# Altium schematic sheet 06-Power.SchDoc
size A
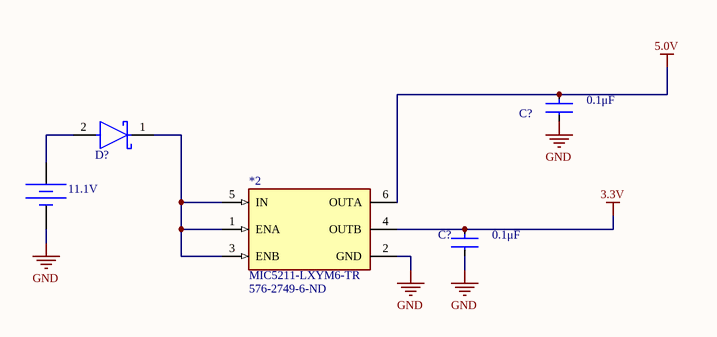
[diagram p0: 06-Power.SchDoc]

## Parts
(Parts that share a designator on the sheet are numbered #1, #2 ... from top to bottom, then left to right.)
11.1V  Constant Voltage Source  (value not drawn)
*2  MIC5211-LXYM6-TR  Supplier Part Number 1: 576-2749-6-ND  [FP-SOT23-6LD-PL-1-MFG]
C?#1  C0805C104K1RACAUTO  [FP-C0805C-DN-IPC_A]  (value not drawn)
C?#2  C0805C104K1RACAUTO  [FP-C0805C-DN-IPC_A]  (value not drawn)
D?  SM5817PL-TP  [On_Semiconductor_425-04_IPC_A]  (value not drawn)

## Nets
3.3V: *2.4(OUTB) C?#2.1
5.0V: *2.6(OUTA) C?#1.1
GND: 11.1V.2 *2.2(GND) C?#1.2 C?#2.2
Net11.1V_1: 11.1V.1 D?.2(A)
Net*2_1: *2.1(ENA) *2.3(ENB) *2.5(IN) D?.1(C)

## Notes on the sheet
- (in symbol CMP-2007-03648-2) 0.1μF

## Library data of the parts
11.1V = Battery: SimulationGenericComponent: True; DC Magnitude: 5
*2 = MIC5211-LXYM6-TR: MIC5211 Series 80 mA 3.3 / 5 V Dual Output SMT LDO Regulator - SOT-23-6; Manufacturer: Microchip; Output Voltage: 5V; Output Current: 80mA; Dropout Voltage: 250mV; Number of Regulators: 2; Max Input Voltage: 16V; Min Input Voltage: 2.5V; Voltage - Output 1: 3.3V; Manufacturer Part Number: MIC5211-LXYM6-TR; RoHS: Yes; Category: Voltage Regulators - Linear; Stock 1: 9077; Pricing 1: 1=1.00000, 25=0.81640, 100=0.76500 (USD); Mount: Surface Mount; Case/Package: SOT-23-6; Number of Pins: 6; Min Operating Temperature: -40°C; Max Operating Temperature: 125°C; Packaging: Cut Tape; Number of Outputs: 2; Current - Output 1: 80mA; Current - Output 2: 80mA; Voltage - Output 2: 5V; REACH SVHC: No SVHC; Lead Free: Lead Free; ComponentLink1URL: http://www.farnell.com/datasheets/1833750.pdf?src-supplier=Farnell; ComponentLink1Description: http://www.farnell.com/datasheets/1833750.pdf?src-supplier=Farnell; ComponentLink2URL: http://www.mouser.com/ds/2/495/mic5211-480031.pdf?src-supplier=Mouser; ComponentLink2Description: http://www.mouser.com/ds/2/495/mic5211-480031.pdf?src-supplier=Mouser; ComponentLink3URL: http://components.arrow.com/part/dataview/42838406S9415880N1374?src-supplier=Arrow+Electronics; ComponentLink3Description: http://components.arrow.com/part/dataview/42838406S9415880N1374?src-supplier=Arrow+Electronics; ComponentLink4URL: http://www.farnell.com/datasheets/1833750.pdf?src-supplier=Element14; ComponentLink4Description: http://www.farnell.com/datasheets/1833750.pdf?src-supplier=Element14; ComponentLink5URL: http://www.microchip.com/mymicrochip/filehandler.aspx?ddocname=en600301&src-supplier=Digi-Key; ComponentLink5Description: http://www.microchip.com/mymicrochip/filehandler.aspx?ddocname=en600301&src-supplier=Digi-Key; ComponentLink6URL: http://www.micrel.com/_PDF/mic5211.pdf?src-supplier=Future+Electronics; ComponentLink6Description: http://www.micrel.com/_PDF/mic5211.pdf?src-supplier=Future+Electronics; Supplier 1: Digi-Key
C?#1 C?#2 = CMP-2007-03648-2: CAP CER 0.1UF 100V X7R 0805; Manufacturer: KEMET; Temperature Coefficient: 30ppm/°C; Capacitance: 0.10 μF; Material: Ceramic; Tolerance: 0.1; Value: 0.10 μF; Category: Cap; Temperature: -55°C to +125°C; ComponentLink2Description: Datasheet; Temperature Range Low: -55°C; Device Class L2: Capacitors; ComponentLink2URL: https://content.kemet.com/datasheets/KEM_C1003_C0G_SMD.pdf; Ipc Land Pattern Name: CAPC200125X78; Temperature Range High: +125°C; Package: C0805C-DN; Temperature Characteristic: X7R; Height: 0.88mm; Digikey Description: CAP CER 0.1UF 100V X7R 0805; Voltage Rating: 100 V; Device Class L3: Ceramic Capacitors; Manufacturer Part Number: C0805C104K1RACAUTO; Device Class L1: Passive Components; Lead Free: Yes; RoHS: TRUE; Automotive: No; Octopart: https://octopart.com/c0805c104k1racauto-kemet-12625098
D? = SM5817PL-TP: DIODE SCHOTTKY 20V 1A SOD123FL; Forward Voltage: 450mV; Max Surge Current: 30A; Element Configuration: Single; Manufacturer 2: MCC; Manufacturer Part Number 2: SM5817PL-TP; RoHS: Yes; Category: Rectifier Diodes; Stock 2: 178040; Pricing 2: 1=0.46000, 10=0.31900, 100=0.16110, 500=0.13144, 1000=0.09752 (USD); Mount: Surface Mount; Number of Pins: 2; Min Operating Temperature: -65°C; Max Operating Temperature: 125°C; Packaging: Tape and Reel; Package Quantity: 1; Average Rectified Current: 1A; Peak Non-Repetitive Surge Current: 30A; Max Reverse Voltage (DC): 20V; Reverse Voltage: 20V; Radiation Hardening: No; RoHS Compliant: Yes; ComponentLink1URL: https://datasheet.ciiva.com/15200/getdatasheetpartid-487494-15200581.pdf?src-supplier=Verical; ComponentLink1Description: https://datasheet.ciiva.com/15200/getdatasheetpartid-487494-15200581.pdf?src-supplier=Verical; ComponentLink2URL: https://datasheet.ciiva.com/912/sm5817pl-sm5819plsod-123fl-912827.pdf?src-supplier=Digi-Key; ComponentLink2Description: https://datasheet.ciiva.com/912/sm5817pl-sm5819plsod-123fl-912827.pdf?src-supplier=Digi-Key; Supplier 1: Digi-Key; Supplier Part Number 1: SM5817PL-TPMSCT-ND